# EAGLE design MICS-2614_BoB_0.9 (EAGLE 7.2.0)
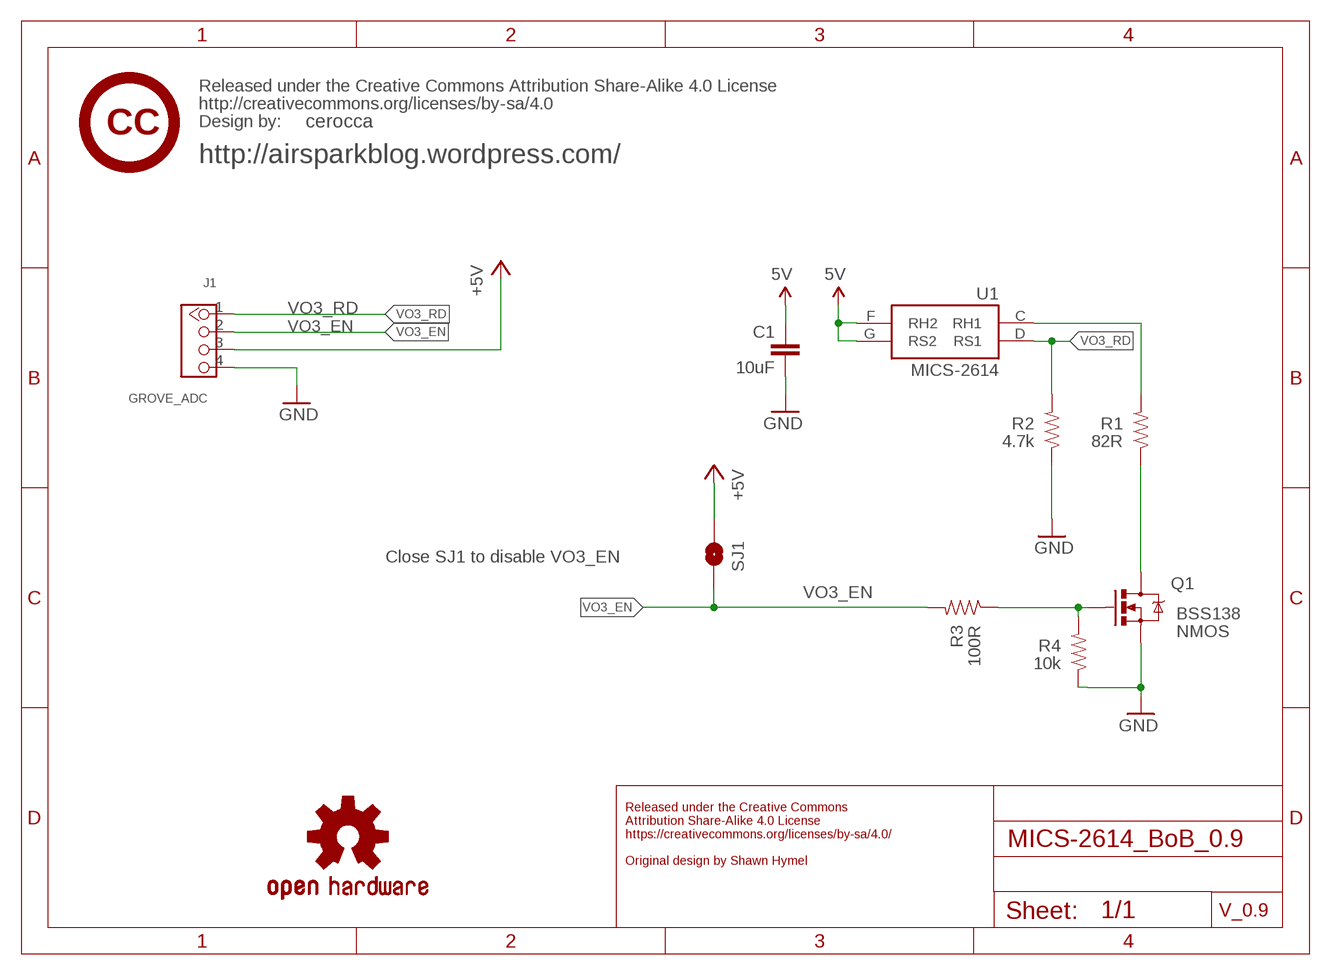
[diagram p0: schematic, sheet 1]

## Parts
C1  10uF  CAP0805  [0805]
J1  GROVE_ADC  TWIG-4P-2.0-2.0  [4P-2.0]
LOGO2  OSHW-LOGOM  [OSHW-LOGO-M]
Q1  BSS138  MOSFET-NCHANNELSMD  [SOT23-3]
R1  82R  RESISTOR0805-RES  [0805]
R2  4.7k  RESISTOR0805-RES  [0805]
R3  100R  RESISTOR0805-RES  [0805]
R4  10k  RESISTOR0805-RES  [0805]
SJ1  SOLDERJUMPERNO  [SJ_2S-NO]
U1  MICS-2614  [MICS_10-SMD]
U$7  CREATIVE_COMMONS  [CREATIVE_COMMONS]
U$8  CC  [CC]

## Nets
+5V: C1.1 J1.3 SJ1.2 U1.F(RH2) U1.G(RS2) ; supply symbol labelled 5V
GND: C1.2 J1.4 Q1.2(S) R2.1 R4.1
N$1: R1.2 U1.C(RH1)
N$2: Q1.3(D) R1.1
N$10: Q1.1(G) R3.1 R4.2
VO3_EN: J1.2 R3.2 SJ1.1
VO3_RD: J1.1 R2.2 U1.D(RS1)

## Notes on the sheet
- cerocca
- http://airsparkblog.wordpress.com/
- Close SJ1 to disable VO3_EN
- NMOS
- Released under the Creative Commons
  Attribution Share-Alike 4.0 License
  https://creativecommons.org/licenses/by-sa/4.0/
  
  Original design by Shawn Hymel
- V_0.9

## Library data of the parts
C1 = SparkFun-Capacitors:CAP: Capacitor Standard 0603 ceramic capacitor, and 0.1" leaded capacitor.; PROD_ID: CAP-11330
J1 = Connector:TWIG-4P-2.0
LOGO2 = Spark:OSHW-LOGO: Open Source Hardware Logo This logo indicates the piece of hardware it is found on incorporates a OSHW license and/or adheres to the definition of open source hardware found here: http://freedomdefined.org/OSHW
Q1 = SparkFun:MOSFET-NCHANNEL
R1-R4 = SparkFun-Resistors:RESISTOR: Resistor Basic schematic elements and footprints for 0603, 1206, and PTH resistors.; DK_ID: 541-82.0CCT-ND
SJ1 = SparkFun:SOLDERJUMPER: Solder Jumper Standard SMD solder jumper. Used to automate production. Two varients : Normally Open and Normally Closed are the same, but have different paste layers. NC will have a large amount of paste and should jumper during reflow.
U1 = SparkFun-Sensors:MICS-2614: Metal oxide MEMS ozone (O3) sensor in an SMD package.; PROD_ID: COMP-12309
U$7 = SparkFun:CREATIVE_COMMONS
U$8 = trash:CC

## Net classes
0 Default: width 0.203 mm

## Board
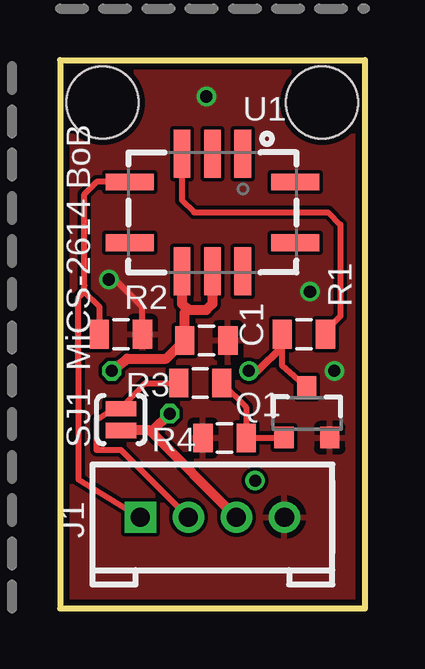
[diagram p1: board, top side]
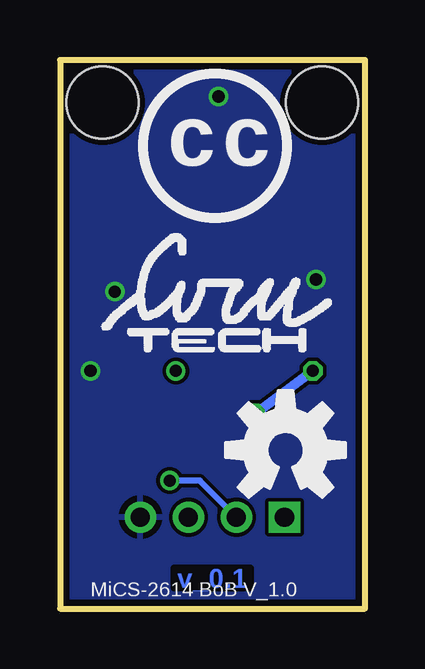
[diagram p2: board, bottom side, seen from below]

Size 12.7 x 22.86 mm. Coordinates in mm from the lower left corner, seen from the top.
Outline: 0,22.86 0,0 12.7,0 12.7,22.86 0,22.86
Copper layers (1*16): Top 0.035mm / dielectric 1.5mm / Bottom 0.035mm
Design rules "SeeedStudio_2layer_DRU_no_angle_20140221": minimum track width 6mil, minimum drill 12mil, track to track 6mil, track to pad 6mil, pad to pad 6mil, via to via 6mil, smd to smd 0mil, copper to edge 10mil, drill to drill 10mil, minimum pad ring 10mil, minimum via ring 6mil, stop-mask expansion 2mil, vias tented up to drill 100mil, thermal gap 10mil
Holes 3 mm at 1.78,21.08 10.92,21.08

### Footprints (pad centres in the part's own frame; a part is rotated, then mirrored left to right if it is on the bottom)
0805 = smd 0.8 x 1.2: 1 -0.9,0; 2 0.9,0
4P-2.0 = drill 0.8 pad 1.27 square: 1 -3,0 | drill 0.8 pad 1.27: 2 -1,0; 3 1,0; 4 3,0
SOT23-3 = smd 0.8 x 0.9: 1 -0.95,-1; 2 0.95,-1; 3 0,1.1
SJ_2S-NO = smd 0.635 x 1.27: 1 -0.45,0; 2 0.45,0
MICS_10-SMD = smd 0.7 x 2: A 1.27,2.45; B 0,2.45; C -1.27,2.45; F -1.27,-2.45; G 0,-2.45; H 1.27,-2.45 | smd 2 x 0.7: D -3.45,1.27; E -3.45,-1.27; J 3.45,-1.27; K 3.45,1.27

### Placement (x,y rotation side)
C1  6.1,11.18 0 top
J1  6.35,3.81 0 top
LOGO2  3.3,6.6 0 bottom
Q1  10.29,8.13 0 top
R1  10.16,11.43 0 top
R2  2.54,11.43 180 top
R3  5.84,9.4 180 top
R4  6.86,7.11 0 top
SJ1  2.54,7.87 270 top
U1  6.35,16.51 0 top
U$1  [CIRU_1X05]  11.43,9.91 0 bottom
U$7  -11.18,-8.38 0 top  (outside the outline)
U$8  6.35,19.3 0 bottom

### Tracks (layer width: path | path; a pad name or v marks a point on that pad's centre or on a via)
+5V  (via drill 0.5)
  Top 0.254: 5.2,12.31 5.33,12.45
  Top 0.406: U1.G 6.35,12.7 6.1,12.45 5.33,12.45 5.08,12.7 U1.F | 5.2,12.31 C1.1 4.43,10.41 2.79,10.41 v2.16,9.91 | J1.3 3.74,7.42 | 3.74,7.42 SJ1.2 | 3.74,7.42 3.87,7.42 v4.57,8.13
  Bottom 0.406: v4.57,8.13 v2.16,9.91
GND  (via drill 0.51)
  Top 0.254: R2.1 3.43,11.44 3.43,12.57 2.29,13.72 v2.03,13.72 | R4.1 6.01,7.06
  other vias: 6.1,21.34 10.41,13.21 11.43,9.91
  pour Bottom: 0,22.86 12.7,22.86 12.7,0 0,0
  pour Top: 0,22.86 12.7,22.86 12.7,0 0,0
N$1
  Top 0.254: U1.C 5.08,17.02 5.59,16.51 11.18,16.51 11.68,16 11.68,12.19 11.06,11.57 R1.2
N$2  (via drill 0.5)
  Top 0.254: Q1.3 9.26,10.13 9.26,10.92 R1.1
  Top 0.305: v7.87,9.91 8.24,9.91 9.26,10.92
N$10
  Top 0.254: R3.1 7.76,8.38 R4.2 7.77,7.13 Q1.1
  Top 0.406: 9.19,7.11 Q1.1
VO3_EN  (via drill 0.5)
  Top 0.254: 2.23,8.32 1.52,7.87 1.52,6.62 2.54,6.62 J1.2 | SJ1.1 3.56,9.4 R3.2
  Top 0.305: 2.23,8.32 SJ1.1
  Bottom 0.254: J1.2 6.87,5.33 v8.13,5.33
VO3_RD
  Top 0.254: U1.D 1.52,17.78 1.02,17.27 1.02,13.46 1.02,13.21 | J1.1 0.76,5.38 0.76,10.16 0.76,12.95 1.02,13.21 | R2.2 1.65,11.44 1.65,12.57 1.02,13.21

### Text on the board
Bottom: v_0.1
tPlace: MiCS-2614 BoB
bPlace: MiCS-2614 BoB V_1.0
tDocu: 12.7 mm | 22.86 mm | cerocca